# EAGLE schematic 200415 eAR ECU PX Sensor PTH R00 (EAGLE 7.6.0)
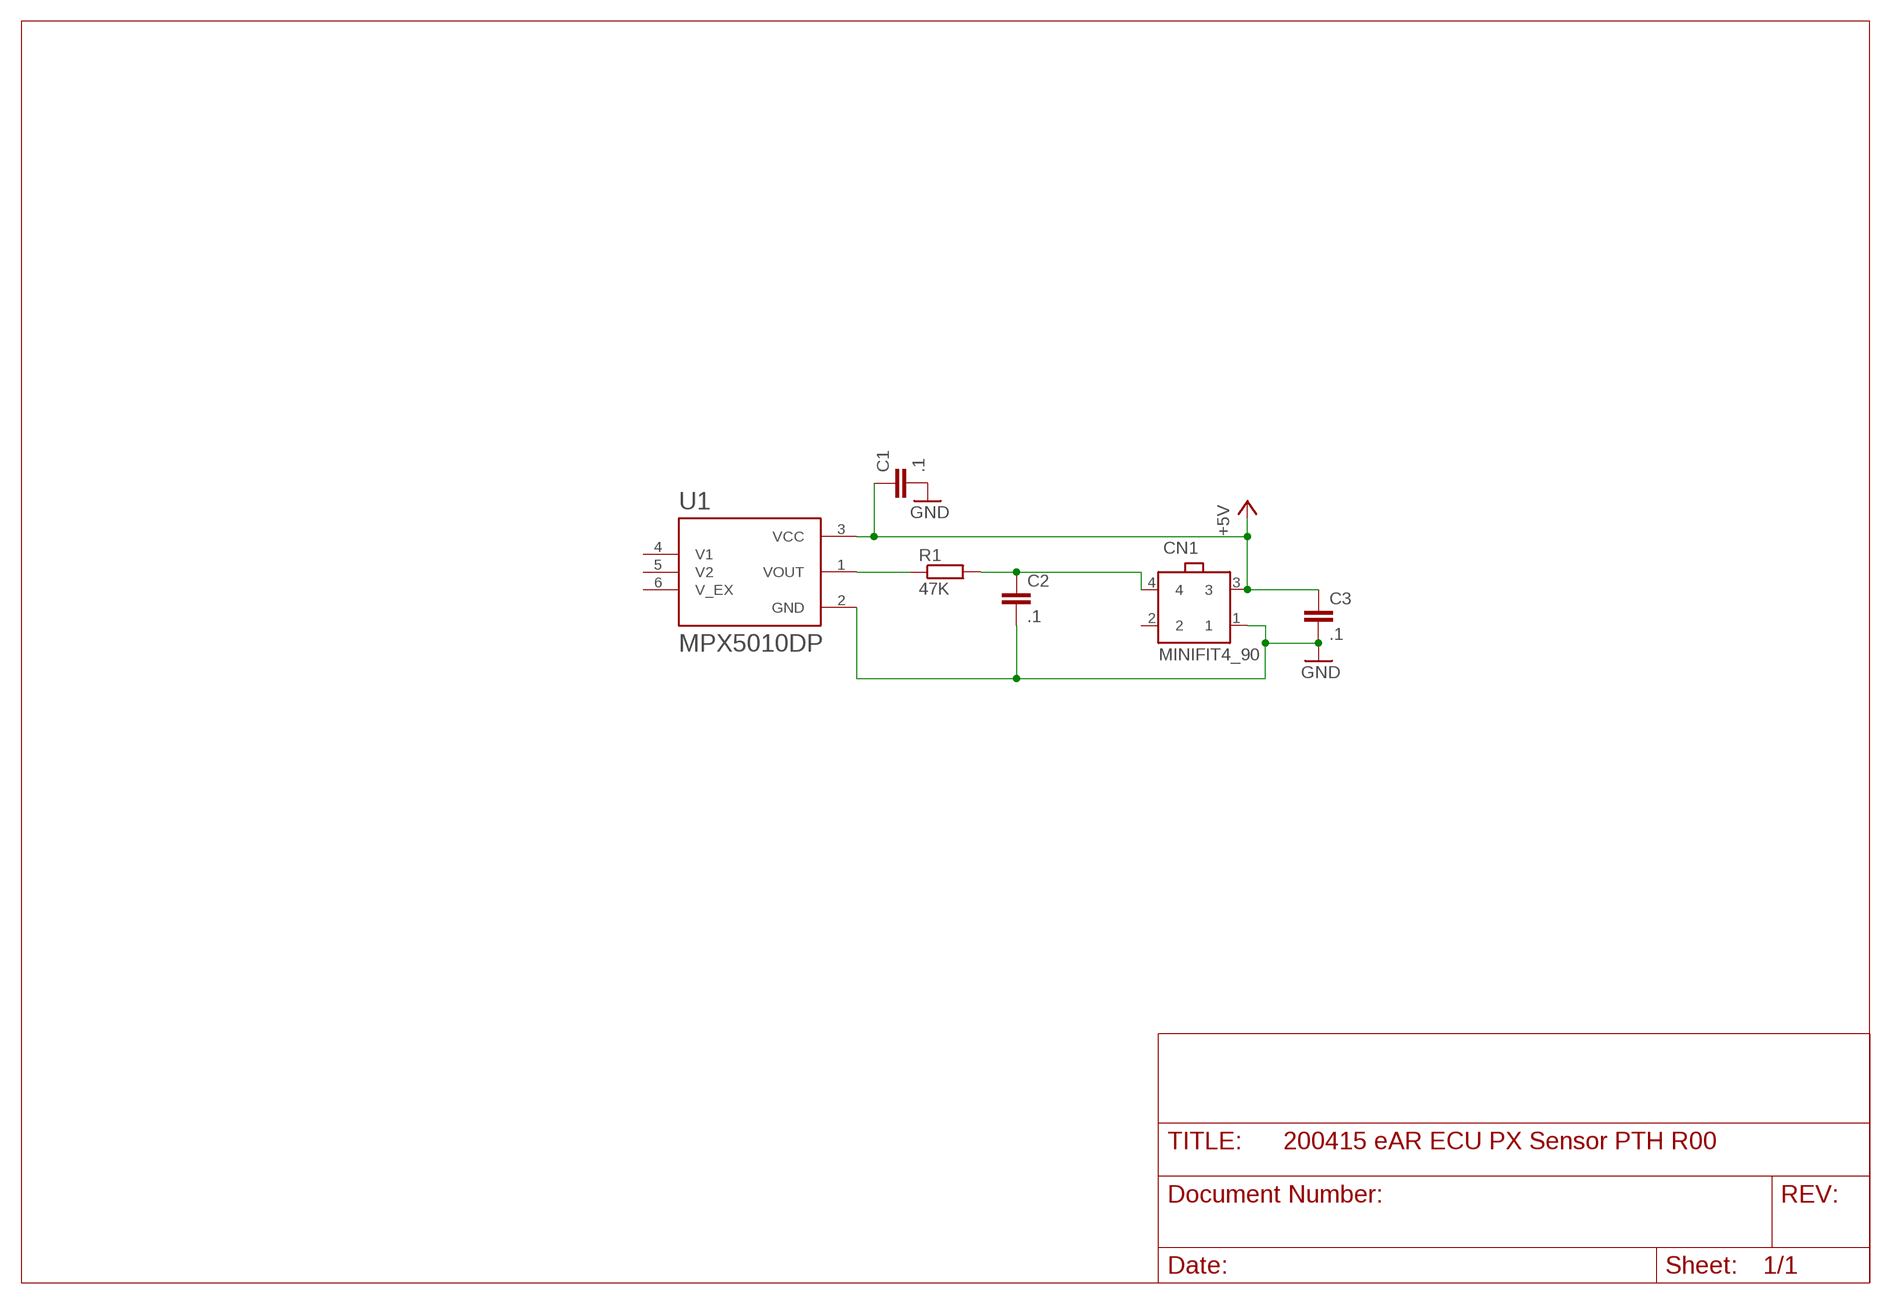
[diagram p0: schematic, sheet 1]

## Parts
C1  .1  C-EU050-025X075  [C050-025X075]
C2  .1  C-EU050-025X075  [C050-025X075]
C3  .1  C-EU050-025X075  [C050-025X075]
CN1  MINIFIT4_90  [MINIFIT4_90]
R1  47K  R-EU_0207/10  [0207/10]
U1  MPX5010DP  [XDCR_MPX5010DP]

## Nets
+5V: C1.1 C3.1 CN1.3 U1.3(VCC)
GND: C1.2 C2.2 C3.2 CN1.1 U1.2(GND)
N$2: C2.1 CN1.4 R1.2
N$6: R1.1 U1.1(VOUT)
Unconnected: CN1.2 U1.4(V1) U1.5(V2) U1.6(V_EX)

## Library data of the parts
C1-C3 = rcl:C-EU: CAPACITOR, European symbol
CN1 = FlexCustom:MINIFIT4_90
R1 = rcl:R-EU_: RESISTOR, European symbol
U1 = MPX5010DP:MPX5010DP: Integrated Silicon Pressure Sensor On-Chip Signal Conditioned, Temperature Compensated and Calibrated 0 to 10 kPa (0 to 1.45 psi) (0 to 1019.78 mm H2O) 0.2 to 4.7 V Outpu; AVAILABILITY: Unavailable; DESCRIPTION: Pressure Sensor 1.45PSI _10kPa_ Differential Male - 0.19 _4.93mm_ Tube 0.2 V ~ 4.7 V 6-SIP Module; MF: NXP USA; MP: MPX5010DP; PACKAGE: SIP-6 NXP Semiconductors; PRICE: None